# EAGLE schematic dcdc_design (EAGLE 9.3.1)

## Sheet 1 of 7: power supply
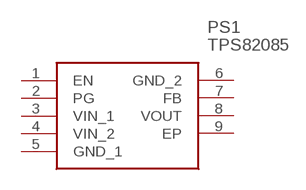
[diagram p0: schematic, sheet 1]

### Parts
PS1  TPS82085  [TPS82085]
Unconnected: PS1.1(EN) PS1.2(PG) PS1.3(VIN_1) PS1.4(VIN_2) PS1.5(GND_1) PS1.6(GND_2) PS1.7(FB) PS1.8(VOUT) PS1.9(EP)

## Sheet 2 of 7: mcu
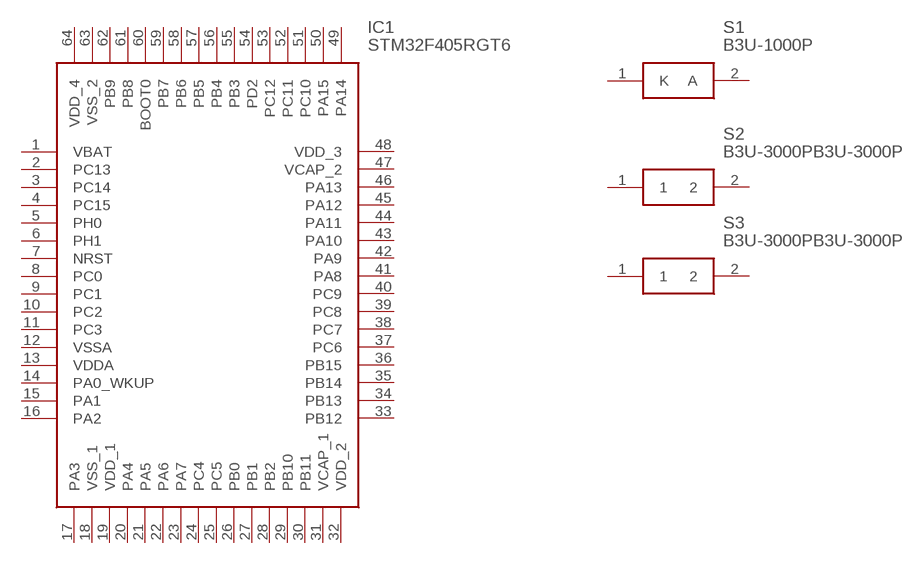
[diagram p1: schematic, sheet 2]

### Parts
IC1  STM32F405RGT6  [QFP50P1200X1200X160-64N]
S1  B3U-1000P  [B3U-1000P]
S2  B3U-3000PB3U-3000P  [B3U-3000P]
S3  B3U-3000PB3U-3000P  [B3U-3000P]
Unconnected: IC1.1(VBAT) IC1.2(PC13) IC1.3(PC14) IC1.4(PC15) IC1.5(PH0) IC1.6(PH1) IC1.7(NRST) IC1.8(PC0) IC1.9(PC1) IC1.10(PC2) IC1.11(PC3) IC1.14(PA0_WKUP) IC1.15(PA1) IC1.16(PA2) IC1.17(PA3) IC1.20(PA4) IC1.21(PA5) IC1.22(PA6) IC1.23(PA7) IC1.24(PC4) IC1.25(PC5) IC1.26(PB0) IC1.27(PB1) IC1.28(PB2) IC1.29(PB10) IC1.30(PB11) IC1.31(VCAP_1) IC1.33(PB12) IC1.34(PB13) IC1.35(PB14) IC1.36(PB15) IC1.37(PC6) IC1.38(PC7) IC1.39(PC8) IC1.40(PC9) IC1.41(PA8) IC1.42(PA9) IC1.43(PA10) IC1.44(PA11) IC1.45(PA12) IC1.46(PA13) IC1.47(VCAP_2) IC1.49(PA14) IC1.50(PA15) IC1.51(PC10) IC1.52(PC11) IC1.53(PC12) IC1.54(PD2) IC1.55(PB3) IC1.56(PB4) IC1.57(PB5) IC1.58(PB6) IC1.59(PB7) IC1.60(BOOT0) IC1.61(PB8) IC1.62(PB9) S1.1(K) S1.2(A) S2.1 S2.2 S3.1 S3.2

## Sheet 3 of 7: gyro+accel
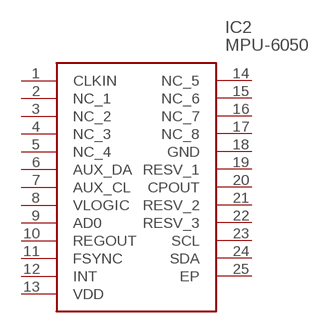
[diagram p2: schematic, sheet 3]

### Parts
IC2  MPU-6050  [MPU6050]
Unconnected: IC2.1(CLKIN) IC2.2(NC_1) IC2.3(NC_2) IC2.4(NC_3) IC2.5(NC_4) IC2.6(AUX_DA) IC2.7(AUX_CL) IC2.8(VLOGIC) IC2.9(AD0) IC2.10(REGOUT) IC2.11(FSYNC) IC2.12(INT) IC2.13(VDD) IC2.14(NC_5) IC2.15(NC_6) IC2.16(NC_7) IC2.17(NC_8) IC2.18(GND) IC2.19(RESV_1) IC2.20(CPOUT) IC2.21(RESV_2) IC2.22(RESV_3) IC2.23(SCL) IC2.24(SDA) IC2.25(EP)

## Sheet 4 of 7: motor controll
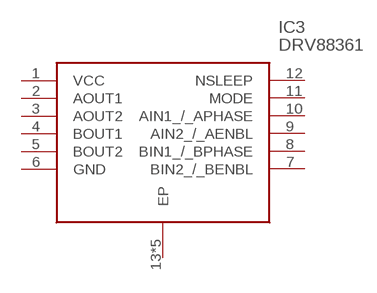
[diagram p3: schematic, sheet 4]

### Parts
IC3  DRV88361  [DRV8836]
Unconnected: IC3.1(VCC) IC3.2(AOUT1) IC3.3(AOUT2) IC3.4(BOUT1) IC3.5(BOUT2) IC3.6(GND) IC3.7(BIN2_/_BENBL) IC3.8(BIN1_/_BPHASE) IC3.9(AIN2_/_AENBL) IC3.10(AIN1_/_APHASE) IC3.11(MODE) IC3.12(NSLEEP) IC3.13(EP) IC3.14(EP) IC3.15(EP) IC3.16(EP) IC3.17(EP)

## Sheet 5 of 7: encoder

## Sheet 6 of 7: IRs and PTs

## Sheet 7 of 7: wireless modul
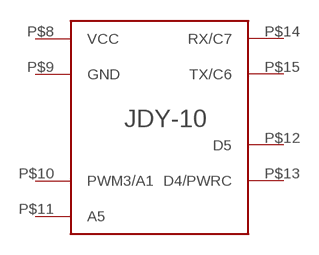
[diagram p4: schematic, sheet 7]

### Parts
U$1  JDY-10_STANDING  [JDY-10_STANDING]
Unconnected: U$1.P$8(VCC) U$1.P$9(GND) U$1.P$10(PWM3/A1) U$1.P$11(A5) U$1.P$12(D5) U$1.P$13(D4/PWRC) U$1.P$14(RX/C7) U$1.P$15(TX/C6)

## Power pins joined to a net without a drawn wire
VDD_1: IC1.19(VDD_1)
VDD_2: IC1.32(VDD_2)
VDD_3: IC1.48(VDD_3)
VDD_4: IC1.64(VDD_4)
VDDA: IC1.13(VDDA)
VSS_1: IC1.18(VSS_1)
VSS_2: IC1.63(VSS_2)
VSSA: IC1.12(VSSA)

## Library data of the parts
IC1 = parts:STM32F405RGT6: MCU 32-Bit, ARM Cortex M4, 1MB Flash STMicroelectronics STM32F405RGT6, 32bit ARM Cortex M4F Microcontroller, 168MHz, 1024 kB Flash, 64-Pin LQFP Source: Datasheet <http://www.mouser.com/datasheet/2/389/stm32f405rg-956214.pdf>; DESCRIPTION: MCU 32-Bit, ARM Cortex M4, 1MB Flash STMicroelectronics STM32F405RGT6, 32bit ARM Cortex M4F Microcontroller, 168MHz, 1024 kB Flash, 64-Pin LQFP; HEIGHT: 1.6mm; MANUFACTURER_NAME: STMicroelectronics; MANUFACTURER_PART_NUMBER: STM32F405RGT6; MOUSER_PART_NUMBER: 511-STM32F405RGT6
IC2 = parts:MPU-6050: IMUs - Inertial Measurement Units 6-Axis MEMS MotionTracking Device with DMP Source: Datasheet <https://www.mouser.mx/datasheet/2/400/MPU-6000-Datasheet1-1112286.pdf>; DESCRIPTION: IMUs - Inertial Measurement Units 6-Axis MEMS MotionTracking Device with DMP; HEIGHT: 3mm; MANUFACTURER_NAME: TDK; MANUFACTURER_PART_NUMBER: MPU-6050; MOUSER_PART_NUMBER: 410-MPU-6050
IC3 = parts:DRV8836: 1.5A Low Voltage Stepper or Single/Dual Brushed DC Motor Driver (PWM or PH/EN Ctrl) Source: Datasheet <http://www.ti.com/lit/gpn/drv8836>; DESCRIPTION: 1.5A Low Voltage Stepper or Single/Dual Brushed DC Motor Driver (PWM or PH/EN Ctrl); HEIGHT: 0.8mm; MANUFACTURER_NAME: Texas Instruments; MANUFACTURER_PART_NUMBER: DRV8836DSSR; MOUSER_PART_NUMBER: 595-DRV8836DSSR
PS1 = parts:TPS82085: TEXAS INSTRUMENTS - TPS82085SILR - DC/DC CONV, SYNC BUCK, 2.4MHZ, USIP-8 Source: Datasheet <http://www.ti.com/lit/ds/symlink/tps82084.pdf>; DESCRIPTION: TEXAS INSTRUMENTS - TPS82085SILR - DC/DC CONV, SYNC BUCK, 2.4MHZ, USIP-8; HEIGHT: 1.33mm; MANUFACTURER_NAME: Texas Instruments; MANUFACTURER_PART_NUMBER: TPS82085SILR; MOUSER_PART_NUMBER: 595-TPS82085SILR
S1 = parts:B3U-1000P: OMRON ELECTRONIC COMPONENTS - B3U-1000P - SWITCH, SPST-NO, 0.05A, 12V, SMD Source: Datasheet <http://www.mouser.com/datasheet/2/307/en-b3u-3615.pdf>; DESCRIPTION: OMRON ELECTRONIC COMPONENTS - B3U-1000P - SWITCH, SPST-NO, 0.05A, 12V, SMD; HEIGHT: mm; MANUFACTURER_NAME: Omron Electronics; MANUFACTURER_PART_NUMBER: B3U-1000P; MOUSER_PART_NUMBER: 653-B3U-1000P
S2 S3 = parts:B3U-3000P: OMRON ELECTRONIC COMPONENTS - B3U-3000P - TACTILE SWITCH, SIDE ACTUATED, SMD Source: Datasheet <http://www.mouser.com/datasheet/2/307/en-b3u-3615.pdf>
U$1 = parts:JDY-10_STANDING